# EAGLE schematic picotouch_synth (EAGLE 9.6.2)
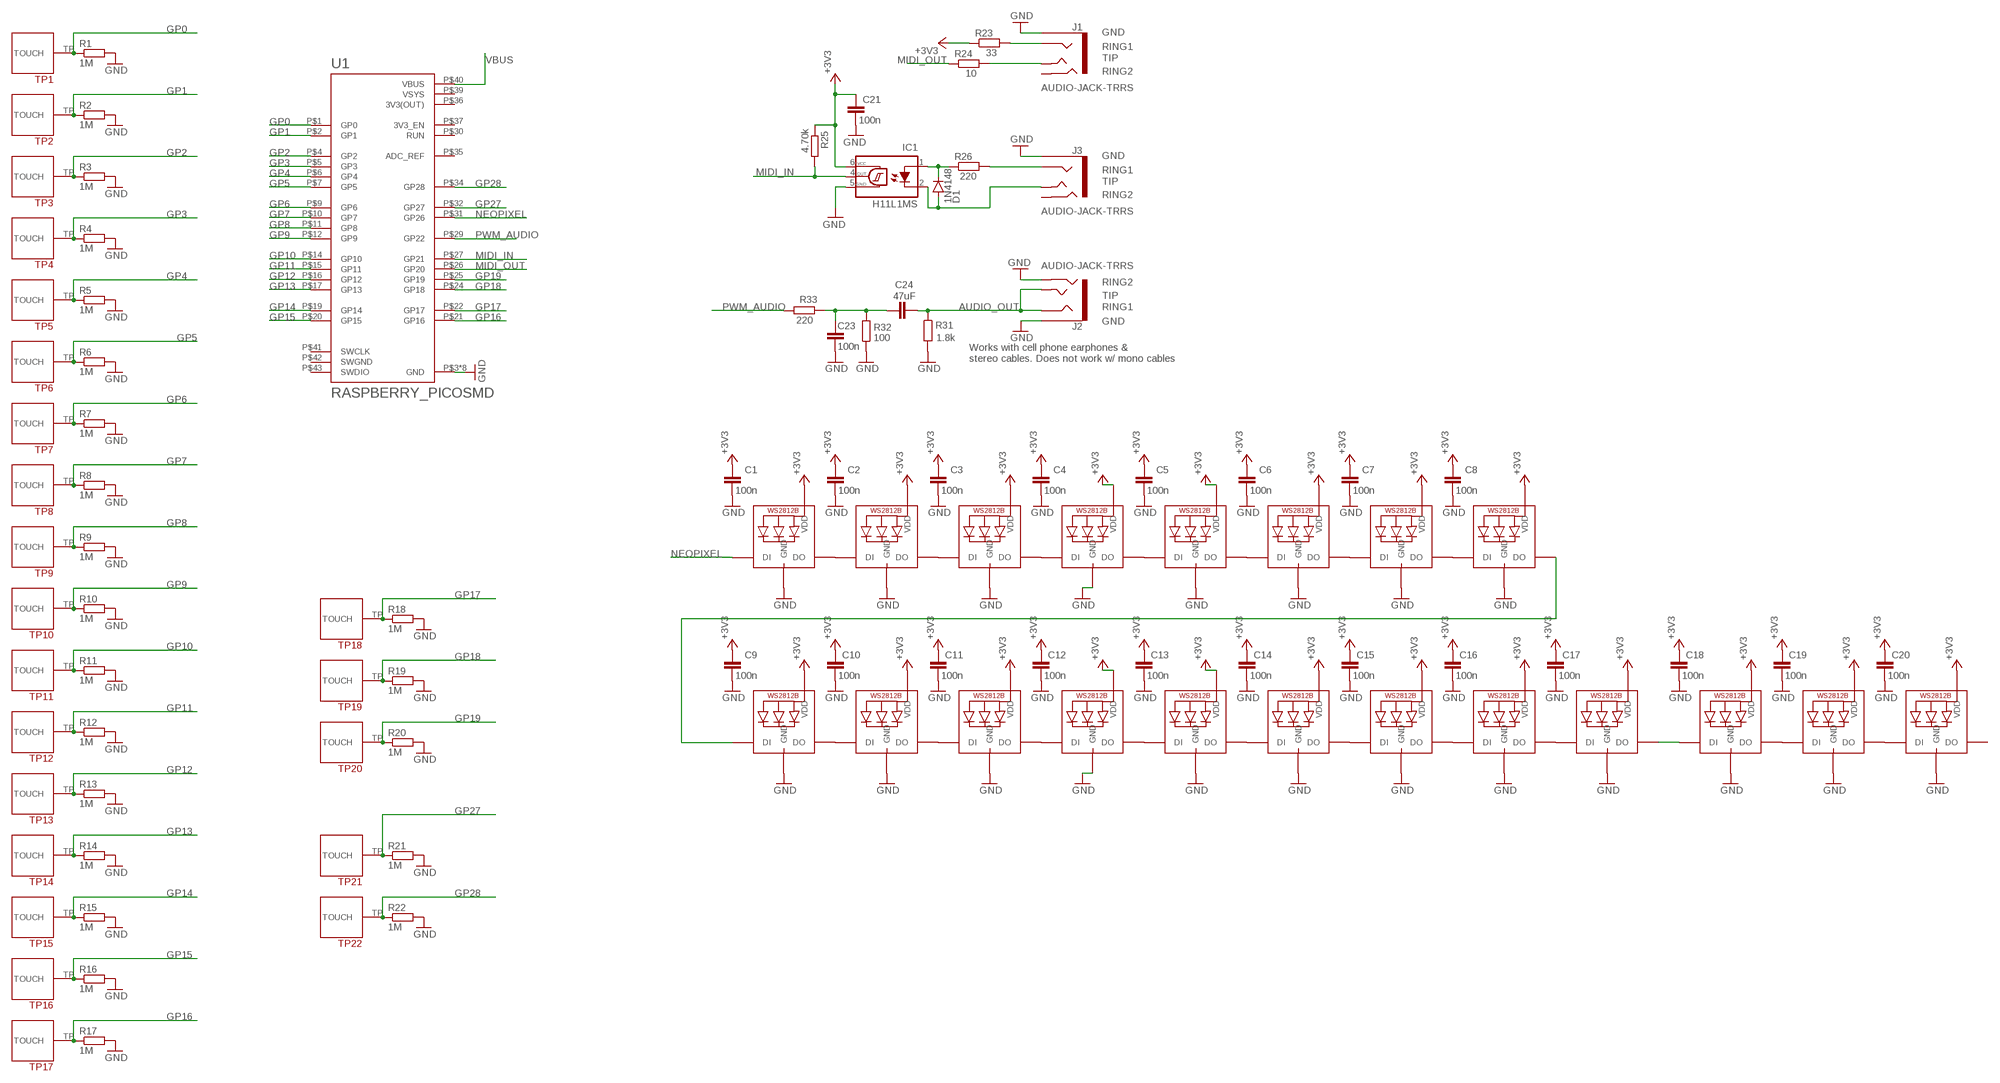
[diagram p0: schematic, sheet 1]

## Parts
C1  100n  C-EUC0603  [C0603]
C2  100n  C-EUC0603  [C0603]
C3  100n  C-EUC0603  [C0603]
C4  100n  C-EUC0603  [C0603]
C5  100n  C-EUC0603  [C0603]
C6  100n  C-EUC0603  [C0603]
C7  100n  C-EUC0603  [C0603]
C8  100n  C-EUC0603  [C0603]
C9  100n  C-EUC0603  [C0603]
C10  100n  C-EUC0603  [C0603]
C11  100n  C-EUC0603  [C0603]
C12  100n  C-EUC0603  [C0603]
C13  100n  C-EUC0603  [C0603]
C14  100n  C-EUC0603  [C0603]
C15  100n  C-EUC0603  [C0603]
C16  100n  C-EUC0603  [C0603]
C17  100n  C-EUC0603  [C0603]
C18  100n  C-EUC0603  [C0603]
C19  100n  C-EUC0603  [C0603]
C20  100n  C-EUC0603  [C0603]
C21  100n  C-EUC0603  [C0603]
C23  100n  C-EUC0603  [C0603]
C24  47uF  C-EUC0603  [C0603]
D1  1N4148  DIODE-SOD123  [SOD123]
IC1  H11L1MS  [DIL6-SMD]
J1  AUDIO-JACK-TRRS  [PJ-320D_SPARKFUN]
J2  AUDIO-JACK-TRRS  [PJ-320D_SPARKFUN]
J3  AUDIO-JACK-TRRS  [PJ-320D_SPARKFUN]
LED1  WS2812B3535  [LED3535]
LED2  WS2812B3535  [LED3535]
LED3  WS2812B3535  [LED3535]
LED4  WS2812B3535  [LED3535]
LED5  WS2812B3535  [LED3535]
LED6  WS2812B3535  [LED3535]
LED7  WS2812B3535  [LED3535]
LED8  WS2812B3535  [LED3535]
LED9  WS2812B3535  [LED3535]
LED10  WS2812B3535  [LED3535]
LED11  WS2812B3535  [LED3535]
LED12  WS2812B3535  [LED3535]
LED13  WS2812B3535  [LED3535]
LED14  WS2812B3535  [LED3535]
LED15  WS2812B3535  [LED3535]
LED16  WS2812B3535  [LED3535]
LED17  WS2812B3535  [LED3535]
LED18  WS2812B3535  [LED3535]
LED19  WS2812B3535  [LED3535]
LED20  WS2812B3535  [LED3535]
R1  1M  R-EU_R0805  [R0805]
R2  1M  R-EU_R0805  [R0805]
R3  1M  R-EU_R0805  [R0805]
R4  1M  R-EU_R0805  [R0805]
R5  1M  R-EU_R0805  [R0805]
R6  1M  R-EU_R0805  [R0805]
R7  1M  R-EU_R0805  [R0805]
R8  1M  R-EU_R0805  [R0805]
R9  1M  R-EU_R0805  [R0805]
R10  1M  R-EU_R0805  [R0805]
R11  1M  R-EU_R0805  [R0805]
R12  1M  R-EU_R0805  [R0805]
R13  1M  R-EU_R0805  [R0805]
R14  1M  R-EU_R0805  [R0805]
R15  1M  R-EU_R0805  [R0805]
R16  1M  R-EU_R0805  [R0805]
R17  1M  R-EU_R0805  [R0805]
R18  1M  R-EU_R0603  [R0603]
R19  1M  R-EU_R0603  [R0603]
R20  1M  R-EU_R0603  [R0603]
R21  1M  R-EU_R0603  [R0603]
R22  1M  R-EU_R0603  [R0603]
R23  33  R-EU_R0603  [R0603]
R24  10  R-EU_R0603  [R0603]
R25  4.70k  R-EU_R0603  [R0603]
R26  220  R-EU_R0603  [R0603]
R31  1.8k  R-EU_R0603  [R0603]
R32  100  R-EU_R0603  [R0603]
R33  220  R-EU_R0603  [R0603]
TP1  TOUCHPADA  [TOUCHPADA]
TP2  TOUCHPADA  [TOUCHPADA]
TP3  TOUCHPADA  [TOUCHPADA]
TP4  TOUCHPADA  [TOUCHPADA]
TP5  TOUCHPADA  [TOUCHPADA]
TP6  TOUCHPADA  [TOUCHPADA]
TP7  TOUCHPADA  [TOUCHPADA]
TP8  TOUCHPADA  [TOUCHPADA]
TP9  TOUCHPADA  [TOUCHPADA]
TP10  TOUCHPADA  [TOUCHPADA]
TP11  TOUCHPADA  [TOUCHPADA]
TP12  TOUCHPADA  [TOUCHPADA]
TP13  TOUCHPADA  [TOUCHPADA]
TP14  TOUCHPADA  [TOUCHPADA]
TP15  TOUCHPADA  [TOUCHPADA]
TP16  TOUCHPADA  [TOUCHPADA]
TP17  TOUCHPADA  [TOUCHPADA]
TP18  TOUCHPADB  [TOUCHPADB]
TP19  TOUCHPADB  [TOUCHPADB]
TP20  TOUCHPADB  [TOUCHPADB]
TP21  TOUCHPADB  [TOUCHPADB]
TP22  TOUCHPADB  [TOUCHPADB]
U1  RASPBERRY_PICOSMD  [PICO-PKG-SMD]

## Nets
+3V3: C1.1 C2.1 C3.1 C4.1 C5.1 C6.1 C7.1 C8.1 C9.1 C10.1 C11.1 C12.1 C13.1 C14.1 C15.1 C16.1 C17.1 C18.1 C19.1 C20.1 C21.1 IC1.6(VCC) LED1.2(VDD) LED2.2(VDD) LED3.2(VDD) LED4.2(VDD) LED5.2(VDD) LED6.2(VDD) LED7.2(VDD) LED8.2(VDD) LED9.2(VDD) LED10.2(VDD) LED11.2(VDD) LED12.2(VDD) LED13.2(VDD) LED14.2(VDD) LED15.2(VDD) LED16.2(VDD) LED17.2(VDD) LED18.2(VDD) LED19.2(VDD) LED20.2(VDD) R23.1 R25.1
AUDIO_OUT: C24.2 J2.RING1 J2.TIP R31.1
GND: C1.2 C2.2 C3.2 C4.2 C5.2 C6.2 C7.2 C8.2 C9.2 C10.2 C11.2 C12.2 C13.2 C14.2 C15.2 C16.2 C17.2 C18.2 C19.2 C20.2 C21.2 C23.2 IC1.5(GND) J1.EARTH J2.EARTH J2.RING2 J3.EARTH LED1.4(GND) LED2.4(GND) LED3.4(GND) LED4.4(GND) LED5.4(GND) LED6.4(GND) LED7.4(GND) LED8.4(GND) LED9.4(GND) LED10.4(GND) LED11.4(GND) LED12.4(GND) LED13.4(GND) LED14.4(GND) LED15.4(GND) LED16.4(GND) LED17.4(GND) LED18.4(GND) LED19.4(GND) LED20.4(GND) R1.2 R2.2 R3.2 R4.2 R5.2 R6.2 R7.2 R8.2 R9.2 R10.2 R11.2 R12.2 R13.2 R14.2 R15.2 R16.2 R17.2 R18.2 R19.2 R20.2 R21.2 R22.2 R31.2 R32.1 U1.P$3(GND) U1.P$8(GND) U1.P$13(GND) U1.P$18(GND) U1.P$23(GND) U1.P$28(GND) U1.P$33(GND) U1.P$38(GND)
GP0: R1.1 TP1.TP(TOUCH) U1.P$1(GP0)
GP1: R2.1 TP2.TP(TOUCH) U1.P$2(GP1)
GP2: R3.1 TP3.TP(TOUCH) U1.P$4(GP2)
GP3: R4.1 TP4.TP(TOUCH) U1.P$5(GP3)
GP4: R5.1 TP5.TP(TOUCH) U1.P$6(GP4)
GP5: R6.1 TP6.TP(TOUCH) U1.P$7(GP5)
GP6: R7.1 TP7.TP(TOUCH) U1.P$9(GP6)
GP7: R8.1 TP8.TP(TOUCH) U1.P$10(GP7)
GP8: R9.1 TP9.TP(TOUCH) U1.P$11(GP8)
GP9: R10.1 TP10.TP(TOUCH) U1.P$12(GP9)
GP10: R11.1 TP11.TP(TOUCH) U1.P$14(GP10)
GP11: R12.1 TP12.TP(TOUCH) U1.P$15(GP11)
GP12: R13.1 TP13.TP(TOUCH) U1.P$16(GP12)
GP13: R14.1 TP14.TP(TOUCH) U1.P$17(GP13)
GP14: R15.1 TP15.TP(TOUCH) U1.P$19(GP14)
GP15: R16.1 TP16.TP(TOUCH) U1.P$20(GP15)
GP16: R17.1 TP17.TP(TOUCH) U1.P$21(GP16)
GP17: R18.1 TP18.TP(TOUCH) U1.P$22(GP17)
GP18: R19.1 TP19.TP(TOUCH) U1.P$24(GP18)
GP19: R20.1 TP20.TP(TOUCH) U1.P$25(GP19)
GP27: R21.1 TP21.TP(TOUCH) U1.P$32(GP27)
GP28: R22.1 TP22.TP(TOUCH) U1.P$34(GP28)
MIDI_IN: IC1.4(OUT) R25.2 U1.P$27(GP21)
MIDI_OUT: R24.1 U1.P$26(GP20)
N$1: D1.C IC1.1(A) R26.1
N$2: J1.TIP R24.2
N$3: D1.A IC1.2(C) J3.TIP
N$4: J3.RING1 R26.2
N$5: C23.1 C24.1 R32.2 R33.1
N$6: J1.RING1 R23.2
N$7: LED1.3(DO) LED2.1(DI)
N$8: LED4.3(DO) LED5.1(DI)
N$9: LED5.3(DO) LED6.1(DI)
N$10: LED6.3(DO) LED7.1(DI)
N$11: LED7.3(DO) LED8.1(DI)
N$12: LED2.3(DO) LED3.1(DI)
N$13: LED3.3(DO) LED4.1(DI)
N$14: LED9.3(DO) LED10.1(DI)
N$15: LED12.3(DO) LED13.1(DI)
N$16: LED13.3(DO) LED14.1(DI)
N$17: LED14.3(DO) LED15.1(DI)
N$18: LED15.3(DO) LED16.1(DI)
N$19: LED10.3(DO) LED11.1(DI)
N$20: LED11.3(DO) LED12.1(DI)
N$21: LED8.3(DO) LED9.1(DI)
N$22: LED16.3(DO) LED17.1(DI)
N$23: LED18.3(DO) LED19.1(DI)
N$25: LED19.3(DO) LED20.1(DI)
N$26: LED17.3(DO) LED18.1(DI)
NEOPIXEL: LED1.1(DI) U1.P$31(GP26)
PWM_AUDIO: R33.2 U1.P$29(GP22)
VBUS: U1.P$40(VBUS)
Unconnected: J1.RING2 J3.RING2 LED20.3(DO) U1.P$30(RUN) U1.P$35(ADC_REF) U1.P$37(3V3_EN) U1.P$41(SWCLK) U1.P$43(SWDIO)

## Notes on the sheet
- GND
- RING1
- TIP
- RING2
- GND
- RING1
- TIP
- RING2
- RING2
- TIP
- RING1
- GND
- Works with cell phone earphones &
  stereo cables. Does not work w/ mono cables

## Power pins joined to a net without a drawn wire
3V3(OUT): U1.P$36(3V3(OUT))
SWGND: U1.P$42(SWGND)
VSYS: U1.P$39(VSYS)

## Library data of the parts
C1-C21 C23 C24 = rcl:C-EU: CAPACITOR, European symbol; SPICEPREFIX: C
D1 = diode:DIODE-: DIODE
IC1 = optocoupler:H11L*M: 6-Pin DIP Optocoupler Source: http://www.fairchildsemi.com/ds/H1/H11L2-M.pdf; LCSC: C78589; MPN2: H11L1S; OC_FARNELL: unknown; OC_NEWARK: unknown
J1-J3 = audio_jacks_todbot:AUDIO-JACK-TRRS; LCSC: C431535; MPN: PJ-320D
LED1-LED20 = todstuff2023:WS2812B
R1-R26 R31-R33 = rcl:R-EU_: RESISTOR, European symbol; SPICEPREFIX: R
TP1-TP22 = todstuff:TOUCHPAD
U1 = RpiPico:RASPBERRY_PICO: Raspberry Pi Pico

## Net classes
1 power: width 0.305 mm